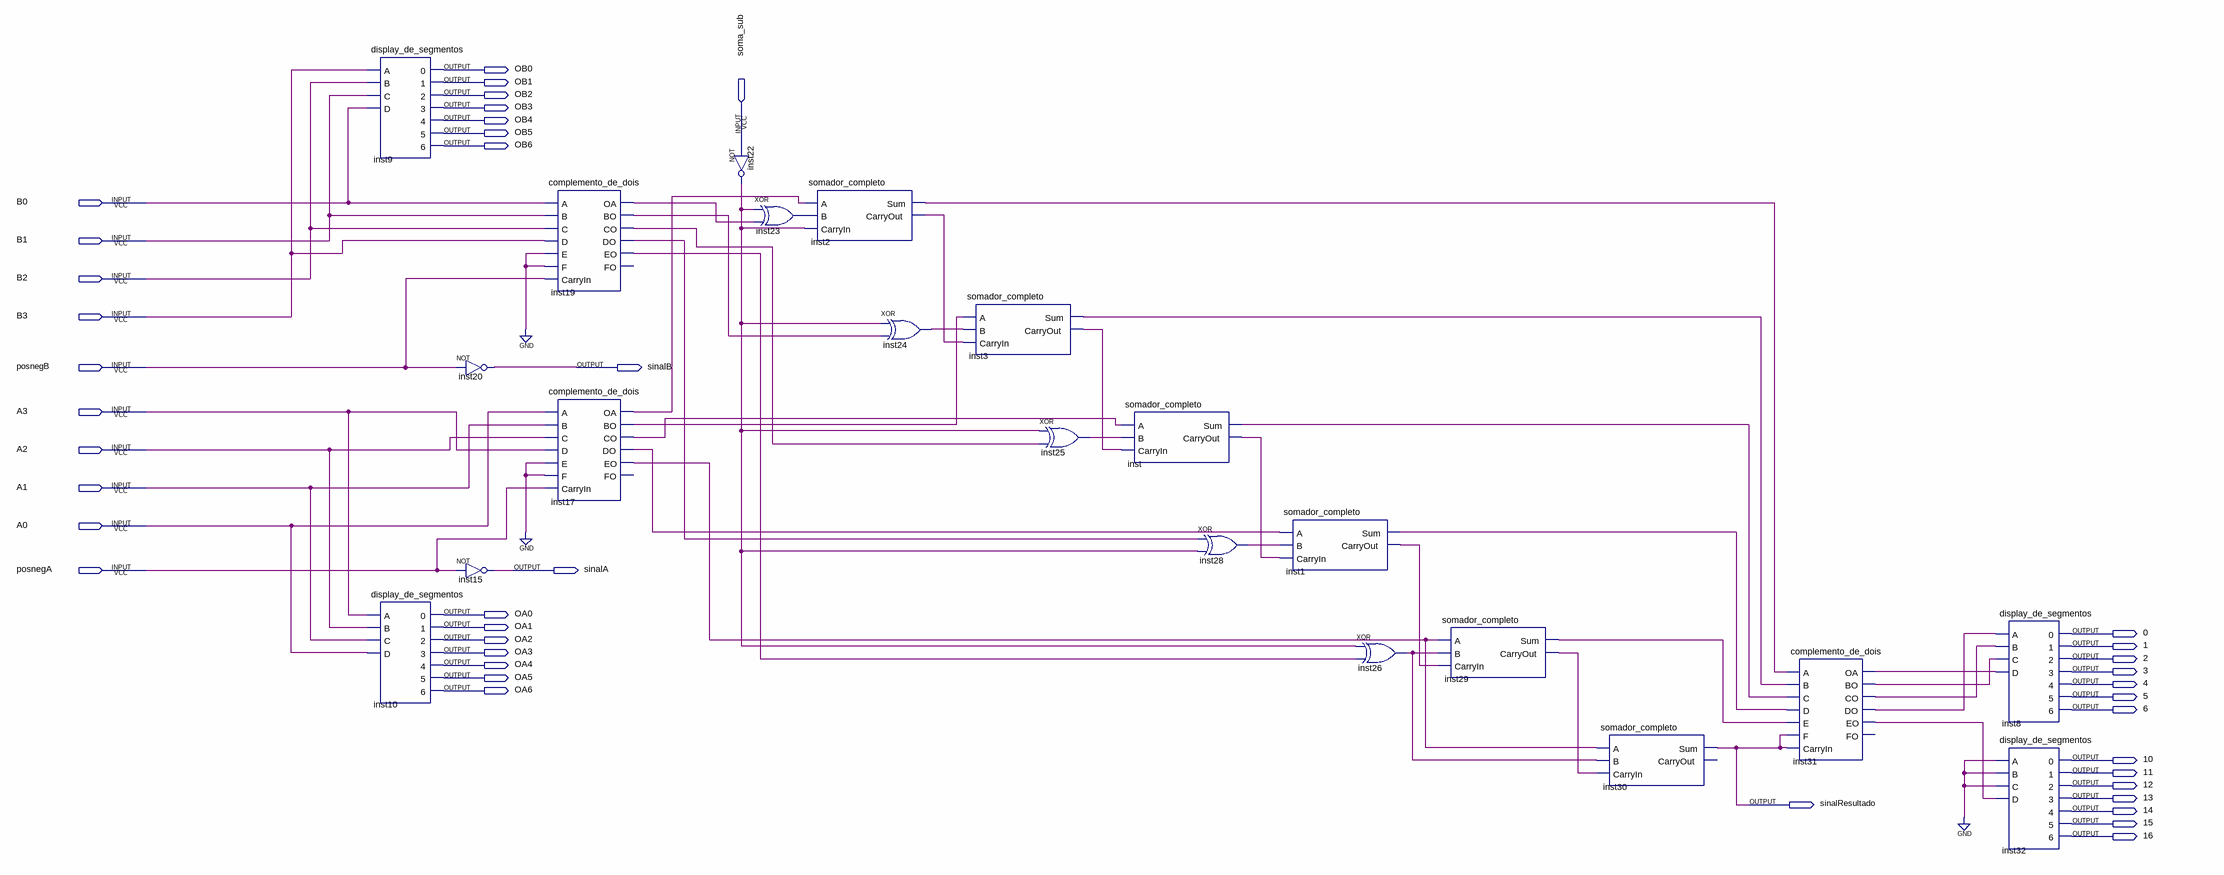
[diagram p0: schematic sheet]
// Quartus schematic Somador-Subtrator.bdf as structural Verilog: 21 symbols, 42 pins
module \Somador-Subtrator  (
  input  soma_sub,
  input  B0,
  input  B1,
  input  B2,
  input  B3,
  input  posnegB,
  input  A3,
  input  A2,
  input  A1,
  input  A0,
  input  posnegA,
  output OB0,
  output OB1,
  output OB2,
  output OB3,
  output OB4,
  output OB5,
  output OB6,
  output sinalB,
  output sinalA,
  output OA0,
  output OA1,
  output \0 ,
  output OA2,
  output \1 ,
  output OA3,
  output \2 ,
  output OA4,
  output \3 ,
  output OA5,
  output \4 ,
  output OA6,
  output \5 ,
  output \6 ,
  output \10 ,
  output \11 ,
  output \12 ,
  output \13 ,
  output sinalResultado,
  output \14 ,
  output \15 ,
  output \16 
);

  wire inst1_carryout, inst1_sum, inst2_carryout, inst2_sum, inst3_carryout, inst3_sum, inst17_bo, inst17_co,
       inst17_do, inst17_eo, inst17_oa, inst19_bo, inst19_co, inst19_do, inst19_eo, inst19_oa, inst22_out,
       inst23_out, inst24_out, inst25_out, inst26_out, inst28_out, inst29_carryout, inst29_sum, inst31_bo,
       inst31_co, inst31_do, inst31_eo, inst31_oa, inst_carryout, inst_sum;

  display_de_segmentos inst9 (
    .A(B3), .B(B2), .C(B1), .D(B0), .\0 (OB0), .\1 (OB1), .\2 (OB2), .\3 (OB3), .\4 (OB4), .\5 (OB5),
    .\6 (OB6));
  display_de_segmentos inst10 (
    .A(A3), .B(A2), .C(A1), .D(A0), .\0 (OA0), .\1 (OA1), .\2 (OA2), .\3 (OA3), .\4 (OA4), .\5 (OA5),
    .\6 (OA6));
  not inst20 (sinalB, posnegB);
  not inst15 (sinalA, posnegA);
  complemento_de_dois inst19 (
    .A(B0), .B(B1), .C(B2), .D(B3), .E(1'b0), .F(1'b0), .CarryIn(posnegB), .OA(inst19_oa), .BO(inst19_bo),
    .CO(inst19_co), .DO(inst19_do), .EO(inst19_eo));  // open: FO
  complemento_de_dois inst17 (
    .A(A0), .B(A1), .C(A2), .D(A3), .E(1'b0), .F(1'b0), .CarryIn(posnegA), .OA(inst17_oa), .BO(inst17_bo),
    .CO(inst17_co), .DO(inst17_do), .EO(inst17_eo));  // open: FO
  not inst22 (inst22_out, soma_sub);
  xor inst23 (inst23_out, inst22_out, inst19_oa);
  somador_completo inst2 (
    .A(inst17_oa), .B(inst23_out), .CarryIn(inst22_out), .Sum(inst2_sum), .CarryOut(inst2_carryout));
  xor inst24 (inst24_out, inst22_out, inst19_bo);
  somador_completo inst3 (
    .A(inst17_bo), .B(inst24_out), .CarryIn(inst2_carryout), .Sum(inst3_sum), .CarryOut(inst3_carryout));
  xor inst25 (inst25_out, inst22_out, inst19_co);
  somador_completo inst (
    .A(inst17_co), .B(inst25_out), .CarryIn(inst3_carryout), .Sum(inst_sum), .CarryOut(inst_carryout));
  xor inst28 (inst28_out, inst19_do, inst22_out);
  somador_completo inst1 (
    .A(inst17_do), .B(inst28_out), .CarryIn(inst_carryout), .Sum(inst1_sum), .CarryOut(inst1_carryout));
  xor inst26 (inst26_out, inst22_out, inst19_eo);
  somador_completo inst29 (
    .A(inst17_eo), .B(inst26_out), .CarryIn(inst1_carryout), .Sum(inst29_sum), .CarryOut(inst29_carryout));
  somador_completo inst30 (
    .A(inst17_eo), .B(inst26_out), .CarryIn(inst29_carryout), .Sum(sinalResultado));  // open: CarryOut
  complemento_de_dois inst31 (
    .A(inst2_sum), .B(inst3_sum), .C(inst_sum), .D(inst1_sum), .E(inst29_sum), .F(sinalResultado),
    .CarryIn(sinalResultado), .OA(inst31_oa), .BO(inst31_bo), .CO(inst31_co), .DO(inst31_do), .EO(inst31_eo));  // open: FO
  display_de_segmentos inst8 (
    .A(inst31_do), .B(inst31_co), .C(inst31_bo), .D(inst31_oa), .\0 (\0 ), .\1 (\1 ), .\2 (\2 ), .\3 (\3 ),
    .\4 (\4 ), .\5 (\5 ), .\6 (\6 ));
  display_de_segmentos inst32 (
    .A(1'b0), .B(1'b0), .C(1'b0), .D(inst31_eo), .\0 (\10 ), .\1 (\11 ), .\2 (\12 ), .\3 (\13 ), .\4 (\14 ),
    .\5 (\15 ), .\6 (\16 ));
endmodule
